# EAGLE design untitled (EAGLE 9.6.2)
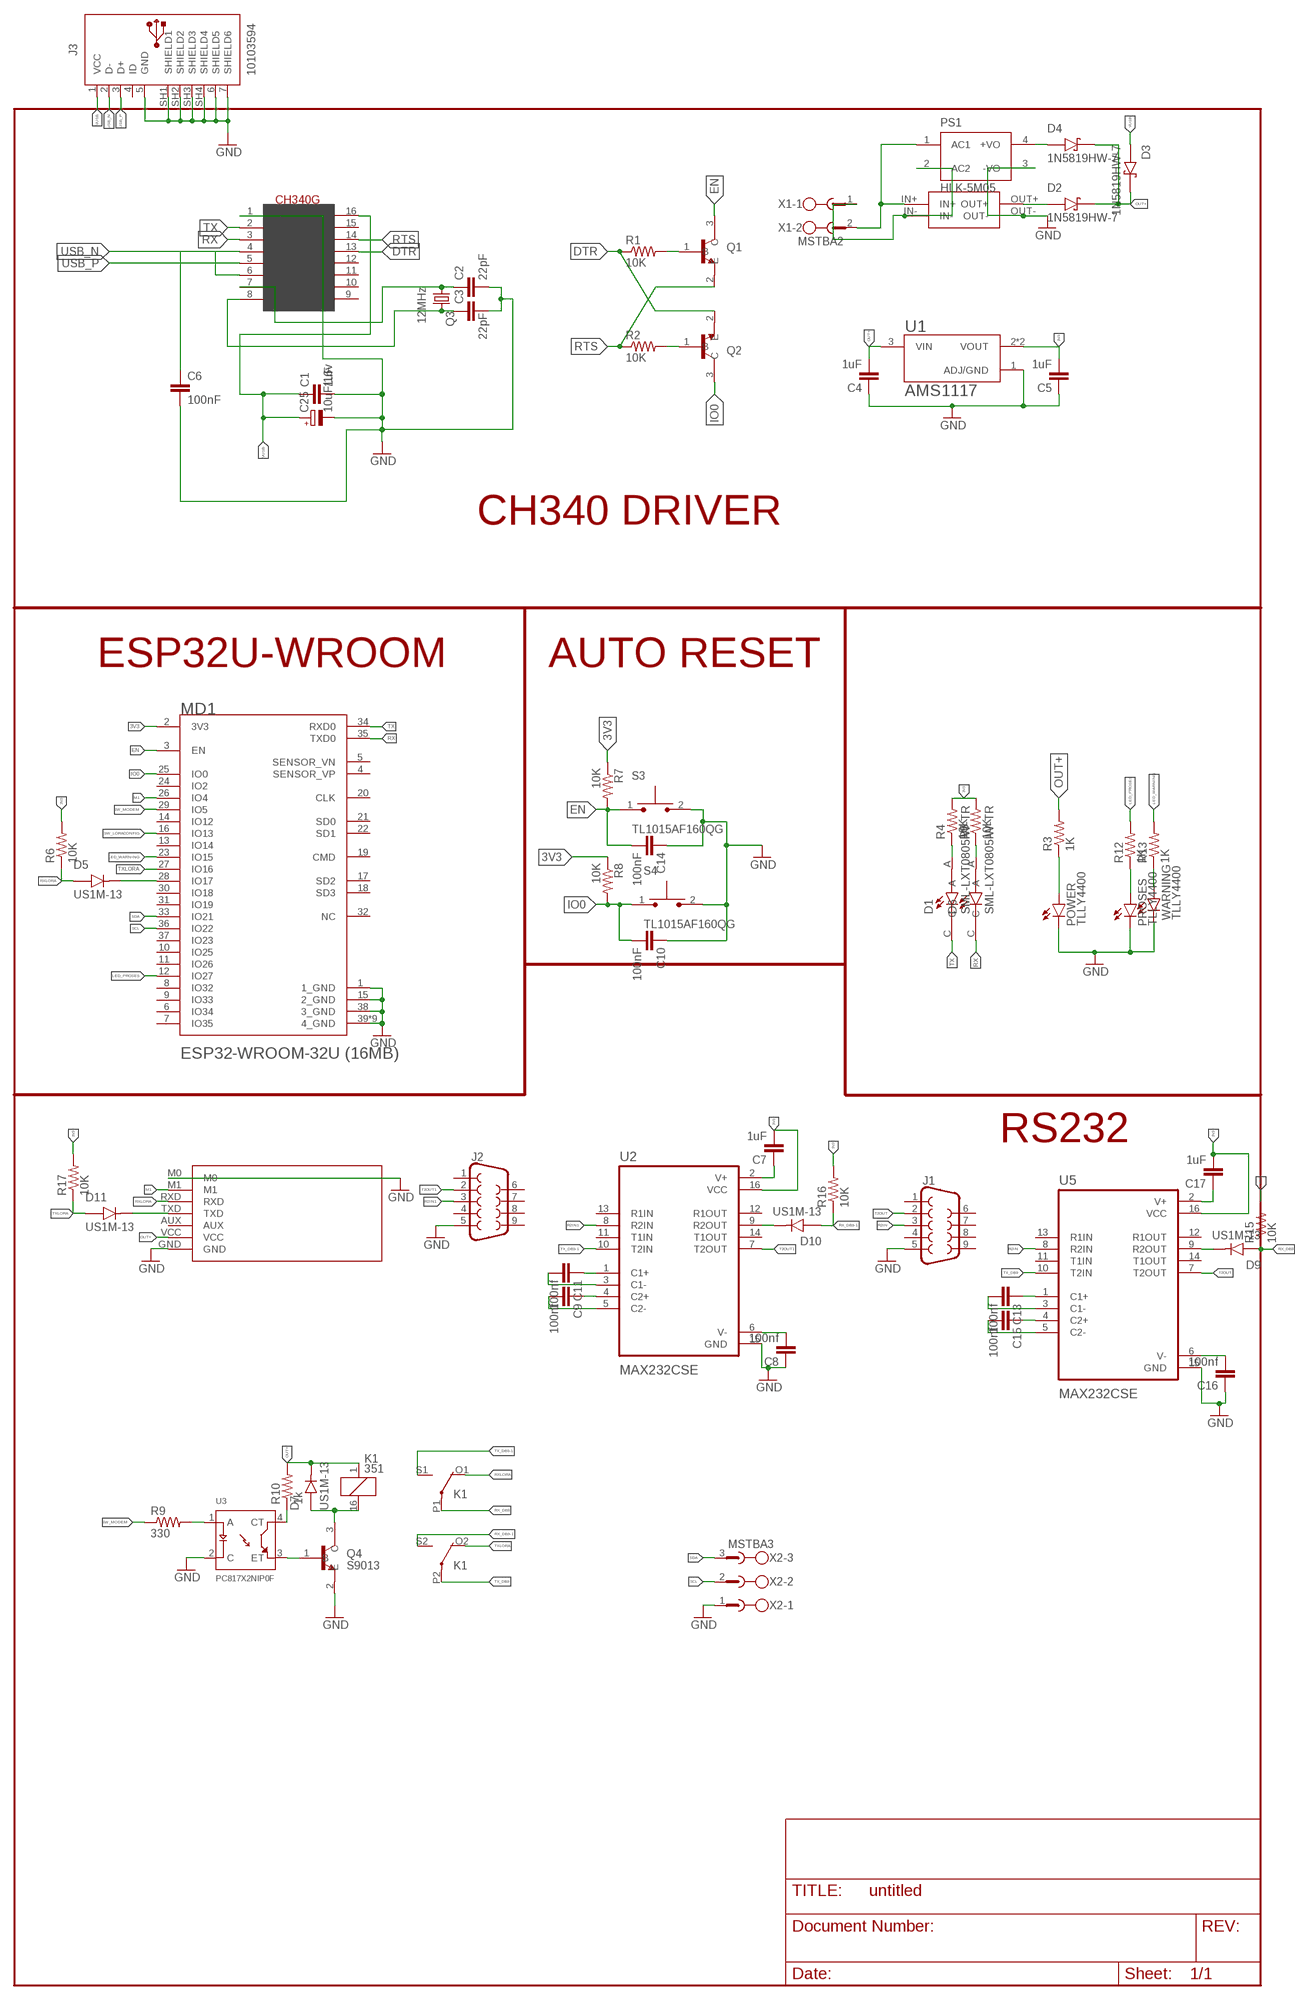
[diagram p0: schematic, sheet 1]

## Parts
C1  1uF  C-EUC0805K  [C0805K]
C2  22pF  C-EUC0805K  [C0805K]
C3  22pF  C-EUC0805K  [C0805K]
C4  1uF  C-EUC0805K  [C0805K]
C5  1uF  C-EUC0805K  [C0805K]
C6  100nF  C-EUC0805K  [C0805K]
C7  1uF  C-EUC0805  [C0805]
C8  100nf  C-EUC0805  [C0805]
C9  100nf  C-EUC0805  [C0805]
C10  100nF  C-EUC0805K  [C0805K]
C11  100nf  C-EUC0805  [C0805]
C13  100nf  C-EUC0805  [C0805]
C14  100nF  C-EUC0805K  [C0805K]
C15  100nf  C-EUC0805  [C0805]
C16  100nf  C-EUC0805  [C0805]
C17  1uF  C-EUC0805  [C0805]
C25  10uF/16v  CPOL-EU153CLV-0505  [153CLV-0505]
D1  SML-LXT0805IW-TR  [LEDC2012X120N]
D2  1N5819HW-7  [SOD3715X145N]
D3  1N5819HW-7  [SOD3715X145N]
D4  1N5819HW-7  [SOD3715X145N]
D5  US1M-13  [DIOM5226X240N]
D6  SML-LXT0805IW-TR  [LEDC2012X120N]
D7  US1M-13  [DIOM5226X240N]
D9  US1M-13  [DIOM5226X240N]
D10  US1M-13  [DIOM5226X240N]
D11  US1M-13  [DIOM5226X240N]
EBYTEE220-900T22D1  EBYTEE220-900T22D  [EBYTEE220-900T22D]
J1  DB9MALE  [DB9_MALE]
J2  DB9MALE  [DB9_MALE]
J3  10103594  [10103594]
K1  351  [351]
MD1  ESPRESSIF_SYSTEMS_ESP32-WROOM-32U_16MBESPRESSIF_SYSTEMS_ESP32-WROOM-32U_16MB_0_0  [ESPRESSIF_SYSTEMS_ESP32-WROOM-32U_16MB_0]
MINI1  MINI560  [MINI560]
POWER  TLLY4400  [LED3MM]
PROSES  TLLY4400  [LED3MM]
PS1  HLK-5M05  [CONV_HLK-5M05]
Q1  MMBT3904  [SOT95P240X120-3N]
Q2  MMBT3904  [SOT95P240X120-3N]
Q3  12MHz  CRYSTALSM49  [SM49]
Q4  S9013  [SOT95P240X120-3N]
R1  10K  R-US_M0805  [M0805]
R2  10K  R-US_M0805  [M0805]
R3  1K  R-US_M0805  [M0805]
R4  10K  R-US_M0805  [M0805]
R5  10K  R-US_M0805  [M0805]
R6  10K  R-US_M0805  [M0805]
R7  10K  R-US_M0805  [M0805]
R8  10K  R-US_M0805  [M0805]
R9  330  R-US_M0805  [M0805]
R10  1k  R-US_M0805  [M0805]
R12  1K  R-US_M0805  [M0805]
R13  1K  R-US_M0805  [M0805]
R15  10K  R-US_M0805  [M0805]
R16  10K  R-US_M0805  [M0805]
R17  10K  R-US_M0805  [M0805]
S3  TL1015AF160QG  [SW_TL1015AF160QG]
S4  TL1015AF160QG  [SW_TL1015AF160QG]
U1  AMS1117  [SOT229P700X180-4N]
U2  MAX232CSE  [SOIC127P600X175-16N]
U3  PC817X2NIP0F  [SOT254P975X400-4N]
U5  MAX232CSE  [SOIC127P600X175-16N]
U$2  CH340G  [SOIC16]
WARNING  TLLY4400  [LED3MM]
X1  MSTBA2  [MSTBA2]
X2  MSTBA3  [MSTBA3]

## Nets
3V3: C5.2 C7.2 C17.2 MD1.2(3V3) R4.2 R5.2 R6.2 R7.1 R8.1 R15.2 R16.2 R17.2 U1.2(VOUT) U1.4(VOUT) U2.16(VCC) U5.16(VCC)
DTR: Q2.2(E) R1.1 U$2.13(DTR)
EN: C14.2 MD1.3(EN) Q1.3(C) R7.2 S3.1
GND: C1.2 C2.2 C3.2 C4.1 C5.1 C6.2 C8.1 C10.1 C14.1 C16.1 C25.- EBYTEE220-900T22D1.GND EBYTEE220-900T22D1.M0 J1.5 J2.5 J3.5(GND) J3.6(SHIELD5) J3.7(SHIELD6) J3.SH1(SHIELD1) J3.SH2(SHIELD2) J3.SH3(SHIELD3) J3.SH4(SHIELD4) MD1.1(1_GND) MD1.15(2_GND) MD1.38(3_GND) MD1.39(4_GND) MD1.39-2(4_GND) MD1.39-3(4_GND) MD1.39-4(4_GND) MD1.39-5(4_GND) MD1.39-6(4_GND) MD1.39-7(4_GND) MD1.39-8(4_GND) MD1.39-9(4_GND) MINI1.OUT- POWER.K(C) PROSES.K(C) PS1.3(-VO) Q4.2(E) S3.2 S4.2 U1.1(ADJ/GND) U2.15(GND) U3.2(C) U5.15(GND) U$2.1(GND) WARNING.K(C) X2.1
IO0: C10.2 MD1.25(IO0) Q2.3(C) R8.2 S4.1
LED_PROSES: MD1.12(IO27) R12.2
LED_WARNING: MD1.23(IO15) R13.2
M1: EBYTEE220-900T22D1.M1 MD1.26(IO4)
N$1: C2.1 Q3.1 U$2.7(XI)
N$2: C3.1 Q3.2 U$2.8(XO)
N$3: POWER.A R3.1
N$4: Q1.1(B) R1.2
N$5: Q2.1(B) R2.2
N$6: MINI1.IN+ PS1.1(AC1) X1.2
N$7: C7.1 U2.2(V+)
N$8: D1.A R4.1
N$9: D6.A R5.1
N$10: C13.1 U5.1(C1+)
N$11: D2.A MINI1.OUT+
N$12: C6.1 U$2.4(V3)
N$13: D5.C(K) MD1.28(IO17)
N$14: C13.2 U5.3(C1-)
N$15: R9.2 U3.1(A)
N$16: R10.1 U3.4(CT)
N$17: C8.2 U2.6(V-)
N$18: Q4.1(B) U3.3(ET)
N$19: C15.1 U5.4(C2+)
N$20: C9.1 U2.4(C2+)
N$21: C9.2 U2.5(C2-)
N$22: C11.2 U2.3(C1-)
N$23: C11.1 U2.1(C1+)
N$24: C15.2 U5.5(C2-)
N$25: PROSES.A R12.1
N$26: C17.1 U5.2(V+)
N$27: C16.2 U5.6(V-)
N$28: R13.1 WARNING.A
N$29: D7.A K1.16 Q4.3(C)
N$34: MINI1.IN- PS1.2(AC2) X1.1
N$35: D4.A PS1.4(+VO)
N$38: D9.C(K) U5.9(R2OUT)
N$39: D10.C(K) U2.9(R2OUT)
N$40: D11.C(K) EBYTEE220-900T22D1.TXD
OUT+: C4.2 D2.C(K) D3.C(K) D4.C(K) D7.C(K) EBYTEE220-900T22D1.VCC K1.1 R3.2 R10.2 U1.3(VIN)
R2IN: J1.3 U5.8(R2IN)
R2IN1: J2.3 U2.8(R2IN)
RTS: Q1.2(E) R2.1 U$2.14(RTS)
RX: D6.C MD1.35(TXD0) U$2.3(RX)
RX_DB9: D9.A K1.P1(2:P) R15.1
RX_DB9-1: D10.A K1.S2(3:S) R16.1
RXLORA: D5.A EBYTEE220-900T22D1.RXD K1.O1(2:O) R6.1
SCL: MD1.36(IO22) X2.2
SDA: MD1.33(IO21) X2.3
SW_LORACONFIG: MD1.16(IO13)
SW_MODEM: MD1.29(IO5) R9.1
T2OUT: J1.2 U5.7(T2OUT)
T2OUT1: J2.2 U2.7(T2OUT)
TX: D1.C MD1.34(RXD0) U$2.2(TX)
TX_DB9: K1.P2(3:P) U5.10(T2IN)
TX_DB9-1: K1.S1(2:S) U2.10(T2IN)
TXLORA: D11.A K1.O2(3:O) MD1.27(IO16) R17.1
USB_N: J3.2(D-) U$2.6(D-)
USB_P: J3.3(D+) U$2.5(D+)
VUSB: C1.1 C25.+ D3.A J3.1(VCC) U$2.16(VCC)
Unconnected: EBYTEE220-900T22D1.AUX J1.1 J1.4 J1.6 J1.7 J1.8 J1.9 J2.1 J2.4 J2.6 J2.7 J2.8 J2.9 J3.4(ID) MD1.4(SENSOR_VP) MD1.5(SENSOR_VN) MD1.6(IO34) MD1.7(IO35) MD1.8(IO32) MD1.9(IO33) MD1.10(IO25) MD1.11(IO26) MD1.13(IO14) MD1.14(IO12) MD1.17(SD2) MD1.18(SD3) MD1.19(CMD) MD1.20(CLK) MD1.21(SD0) MD1.22(SD1) MD1.24(IO2) MD1.30(IO18) MD1.31(IO19) MD1.32(NC) MD1.37(IO23) U2.11(T1IN) U2.12(R1OUT) U2.13(R1IN) U2.14(T1OUT) U5.11(T1IN) U5.12(R1OUT) U5.13(R1IN) U5.14(T1OUT) U$2.9(CTS) U$2.10(DSR) U$2.11(RI) U$2.12(DCD) U$2.15(RS232)

## Notes on the sheet
- CH340 DRIVER
- ESP32U-WROOM | AUTO RESET
- RS232

## Library data of the parts
C1-C11 C13-C17 = rcl:C-EU: CAPACITOR, European symbol; SPICEPREFIX: C
C25 = rcl:CPOL-EU: POLARIZED CAPACITOR, European symbol; SPICEPREFIX: C
D1 D6 = SML-LXT0805IW-TR:SML-LXT0805IW-TR: LED; Luminous Intensity:11µcd; Viewing Angle:140°; Forward Current:30mA; Forward Voltage:2V; Color:Red; LED Color:Red; Leaded Process Compatible:Yes; Lens Color:White; Mounting Type:Surface Mount ;RoHS Compliant: Yes Check availability <https://pricing.snapeda.com/parts/SML-LXT0805IW-TR/Lumex%20Opto/Components/view-part?ref=eda>; AVAILABILITY: In Stock; DESCRIPTION: Red - LED Indication - Discrete 2V 0805 (2012 Metric); MF: Lumex Opto/Components; MP: SML-LXT0805IW-TR; PACKAGE: 0805 Lumex; PRICE: None; PURCHASE-URL: https://pricing.snapeda.com/search/part/SML-LXT0805IW-TR/?ref=eda
D2-D4 = 1N5819HW-7:1N5819HW-7: 1N5819HW Series 40 V 1 A Surface Mount Schottky Barrier Rectifier - SOD-123 Check availability <https://pricing.snapeda.com/parts/1N5819HW-7/Diodes%20Inc./view-part?ref=eda>; AVAILABILITY: In Stock; DESCRIPTION: Diode Schottky 40 V 1A Surface Mount SOD-123; MF: Diodes Inc.; MP: 1N5819HW-7; PACKAGE: SOD-123 Fairchild Semiconductor; PRICE: None; PURCHASE-URL: https://pricing.snapeda.com/search/part/1N5819HW-7/?ref=eda
D5 D7 D9-D11 = US1M-13:US1M-13: Diode, Fast Recovery, 1a, 1kv, Do-214ac-2, Full Reel Check availability <https://pricing.snapeda.com/parts/US1M-13/Diodes%20Incorporated/view-part?ref=eda>; AVAILABILITY: In Stock; DESCRIPTION: Diode Standard 1000 V 1A Surface Mount SMA; MF: Diodes Incorporated; MP: US1M-13; PACKAGE: DO-214AC-214 Diodes Incorporated; PRICE: None; PURCHASE-URL: https://pricing.snapeda.com/search/part/US1M-13/?ref=eda
EBYTEE220-900T22D1 = EByte E220-900T22D:EBYTEE220-900T22D
J1 J2 = SparkFun-Connectors:DB9: DB9 Connector Standard DB9 (D-Sub 9) serial connector. Can be used for CAN bus as well as RS485 and RS232. Footprint production proven. Here is the female version connector we sell at SparkFun: 9 Pin Female Serial Connector - PCB Mount <https://www.sparkfun.com/products/429> (PRT-00429) This connector has been used on the following SparkFun products: SparkFun RS232 Shifter - SMD <https://www.sparkfun.com/products/449> (PRT-00449) SparkFun RS232 Shifter SMD (No DB9) <https://www.sparkfun.com/products/8780> (PRT-08780); PROD_ID: CONN-09904
J3 = Connector_USB:10103594: USB(2.0) Micro-B, RCPT, 5POS, SMD-THT-R/A Datasheet <https://cdn.amphenol-icc.com/media/wysiwyg/files/documentation/datasheet/inputoutput/io_usb_micro.pdf> Drawing <https://cdn.amphenol-icc.com/media/wysiwyg/files/drawing/10103594.pdf>; CATEGORY: Connectors; CONTACTS: 5; CURRENT-RATING: 1.8A; DESCRIPTION: CONN RCPT USB2.0 MICRO B SMD R/A; GENDER: Receptacle; MANUFACTURER: Amphenol ICC (FCI); MOUNT_TYPE: R/A; MPN: 10103594-0001LF; OPERATING_TEMPERATURE: -30°C ~ 80°C; PART_STATUS: ACTIVE; ROHS_COMPLIANT: COMPLIANT; SUB_CATEGORY: USB; TYPE: USB-micro B; VOLTAGE-RATING: 100VAC
K1 = relay:351: RELAY 2 x switch, Omron; OC_FARNELL: unknown; OC_NEWARK: unknown
MD1 = Espressif Systems - ESP32-WROOM-32U (16MB):ESPRESSIF_SYSTEMS_ESP32-WROOM-32U_16MB: Bluetooth, WiFi 802.11b/g/n, Bluetooth v4.2 +EDR, Class 1, 2 and 3 Transceiver Module 2.4GHz ~ 2.5GHz Antenna Not Included, U.FL Surface Mount; AUTOMOTIVE: No; BANDWIDTH: 72MHz; CENTROID_NOT_SPECIFIED: No; DATASHEET: https://www.espressif.com/sites/default/files/documentation/esp32-wroom-32d_esp32-wroom-32u_datasheet_en.pdf; DATA_RATE: 150Mbits/s; DEVICE_CLASS_L1: Integrated Circuits (ICs); DEVICE_CLASS_L2: RF Semiconductors and Devices; DEVICE_CLASS_L3: Transceivers; DIGIKEY_DESCRIPTION: RX TXRX MODULE WIFI U.FL SMD; DIGIKEY_PART_NUMBER: 1904-1028-1-ND; FOOTPRINT_VARIANT_NAME_0: Recommended_Land_Pattern; HEIGHT: 3.35mm; INTERFACE: I2C,SPI,UART,Ethernet,I2S,Other; LEAD_FREE: Yes; MAX_FREQUENCY: 2484MHz; MAX_SUPPLY_VOLTAGE: 3.6V; MF: Espressif Systems; MFG_PACKAGE_IDENT: 0; MFG_PACKAGE_IDENT_DATE: 0; MFG_PACKAGE_IDENT_REV: 0; MIN_SUPPLY_VOLTAGE: 3V; MOUSER_PART_NUMBER: 356-ES32WROOM32U16MB; MPN: ESP32-WROOM-32U (16MB); NOMINAL_SUPPLY_CURRENT: 0.5A; NUMBER_OF_ADC_CHANNELS: 16; NUMBER_OF_GPIO: 26; PACKAGE: BT_MODULE; PREFIX: MD; ROHS: Yes; SENSITIVITY: -98dBm; TEMPERATURE_RANGE_HIGH: +85°C; TEMPERATURE_RANGE_LOW: -40°C; VERIFICATION_VERSION: 0.0.0.3
MINI1 = MINI560:MINI560
POWER PROSES WARNING = led:TLLY4400: Low Current (2mA) LED 3 mm Tinted Diffused Package color YELLOW Source: Data sheet <http://www.farnell.com/datasheets/391098.pdf>; MF: VISHAY SEMICONDUCTOR; OC_FARNELL: 1612439
PS1 = HLK-5M05:HLK-5M05: AC DC 220V to 5V 5W 5Watt Isolated Switching Step-Down Power Supply Module Converter Check availability <https://pricing.snapeda.com/parts/HLK-5M05/Hi-link/view-part?ref=eda>; AVAILABILITY: Not in stock; MF: Hi-link; MP: HLK-5M05; PACKAGE: Package; PRICE: None
Q1 Q2 = MMBT3904:MMBT3904: MMBT3904 Series 40 V CE Breakdown 0.2 A NPN General Purpose Amplifier - SOT-23 Check availability <https://pricing.snapeda.com/parts/MMBT3904/STMicroelectronics/view-part?ref=eda>; AVAILABILITY: Not in stock; DESCRIPTION: SMD Transistor MMBT3904 SOT-23 SMD DIOTEC; MF: STMicroelectronics; MP: MMBT3904; PACKAGE: SOT-23 ON; PRICE: None
Q3 = adafruit:CRYSTAL: CRYSTAL; OC_FARNELL: unknown; OC_NEWARK: unknown
Q4 = S9013:S9013: SMD Transistors NPN 25V-500mA Check availability <https://pricing.snapeda.com/parts/S9013/JCET/view-part?ref=eda>; AVAILABILITY: In Stock; DESCRIPTION: Bipolar (BJT) Transistor NPN 20V 500mA 625mW Through Hole TO-92-3; MF: JCET; MP: S9013; PACKAGE: SOT-23-3 JCET; PRICE: None; PURCHASE-URL: https://pricing.snapeda.com/search/part/S9013/?ref=eda
R1-R10 R12 R13 R15-R17 = adafruit:R-US_: RESISTOR, American symbol
S3 S4 = TL1015AF160QG:TL1015AF160QG: Tactile Switch SPST-NO Top Actuated Surface Mount Check availability <https://pricing.snapeda.com/parts/TL1015AF160QG/E-Switch/view-part?ref=eda>; AVAILABILITY: In Stock; DESCRIPTION: Tactile Switch SPST-NO Top Actuated Surface Mount; MF: E-Switch; MP: TL1015AF160QG; PACKAGE: None; PRICE: None; PURCHASE-URL: https://pricing.snapeda.com/search/part/TL1015AF160QG/?ref=eda
U1 = AMS1117:AMS1117: Sot223/Pkg 1-Amp 5-Volt Low Drop Out Voltage Regulatator Check availability <https://pricing.snapeda.com/parts/AMS1117/Advanced%20Monolithic%20Systems/view-part?ref=eda>; AVAILABILITY: Not in stock; DESCRIPTION: 1A LOW DROPOUT VOLTAGE REGULATOR SOT-223; MF: Advanced Monolithic Systems; MP: AMS1117; PACKAGE: SOT-223 Seeed Technology; PRICE: None
U2 U5 = MAX232CSE:MAX232CSE: Check availability <https://pricing.snapeda.com/parts/MAX232CSE/Maxim%20Integrated/view-part?ref=eda>; AVAILABILITY: In Stock; DESCRIPTION: 2/2 Transceiver Full RS232 16-SOIC; MF: Maxim Integrated; MP: MAX232CSE; PACKAGE: SOIC-16 Maxim Integrated; PRICE: None; PURCHASE-URL: https://pricing.snapeda.com/search/part/MAX232CSE/?ref=eda
U3 = PC817X2NIP0F:PC817X2NIP0F: PC817 Series 1 Channel 80 V 5000 Vrms General Purpose Photocoupler - DIP-4 Check availability <https://pricing.snapeda.com/parts/PC817X2NIP0F/Sharp%20Microelectronics/view-part?ref=eda>; AVAILABILITY: Not in stock; DESCRIPTION: Optoisolator Transistor Output 5000Vrms 1 Channel 4-SMD; MF: Sharp Microelectronics; MP: PC817X2NIP0F; PACKAGE: SMD-4 Sharp Microelectronics; PRICE: None
U$2 = usb-serial:CH340G
X1 = con-phoenix-508:MSTBA2: PHOENIX; MF: FARNELL; MPN: 1757242; OC_FARNELL: 3705171; OC_NEWARK: 71C4161
X2 = con-phoenix-508:MSTBA3: PHOENIX; MF: FARNELL; MPN: 1757255; OC_FARNELL: 3705183; OC_NEWARK: 71C4162

## Net classes
0 default: width 0.2 mm, clearance 0.15 mm

## Board
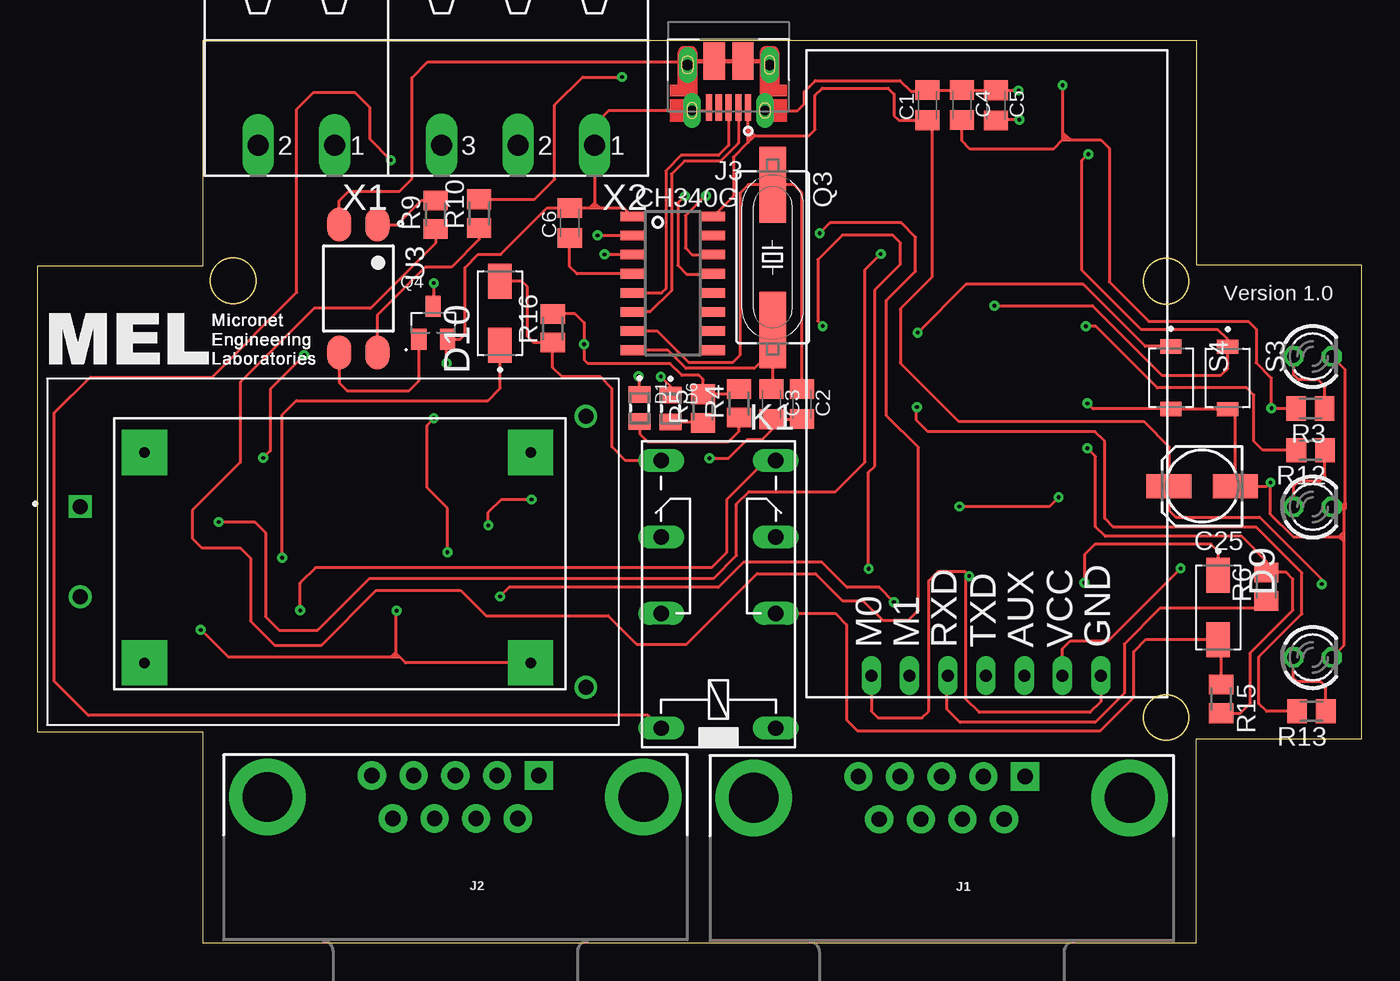
[diagram p1: board, top side]
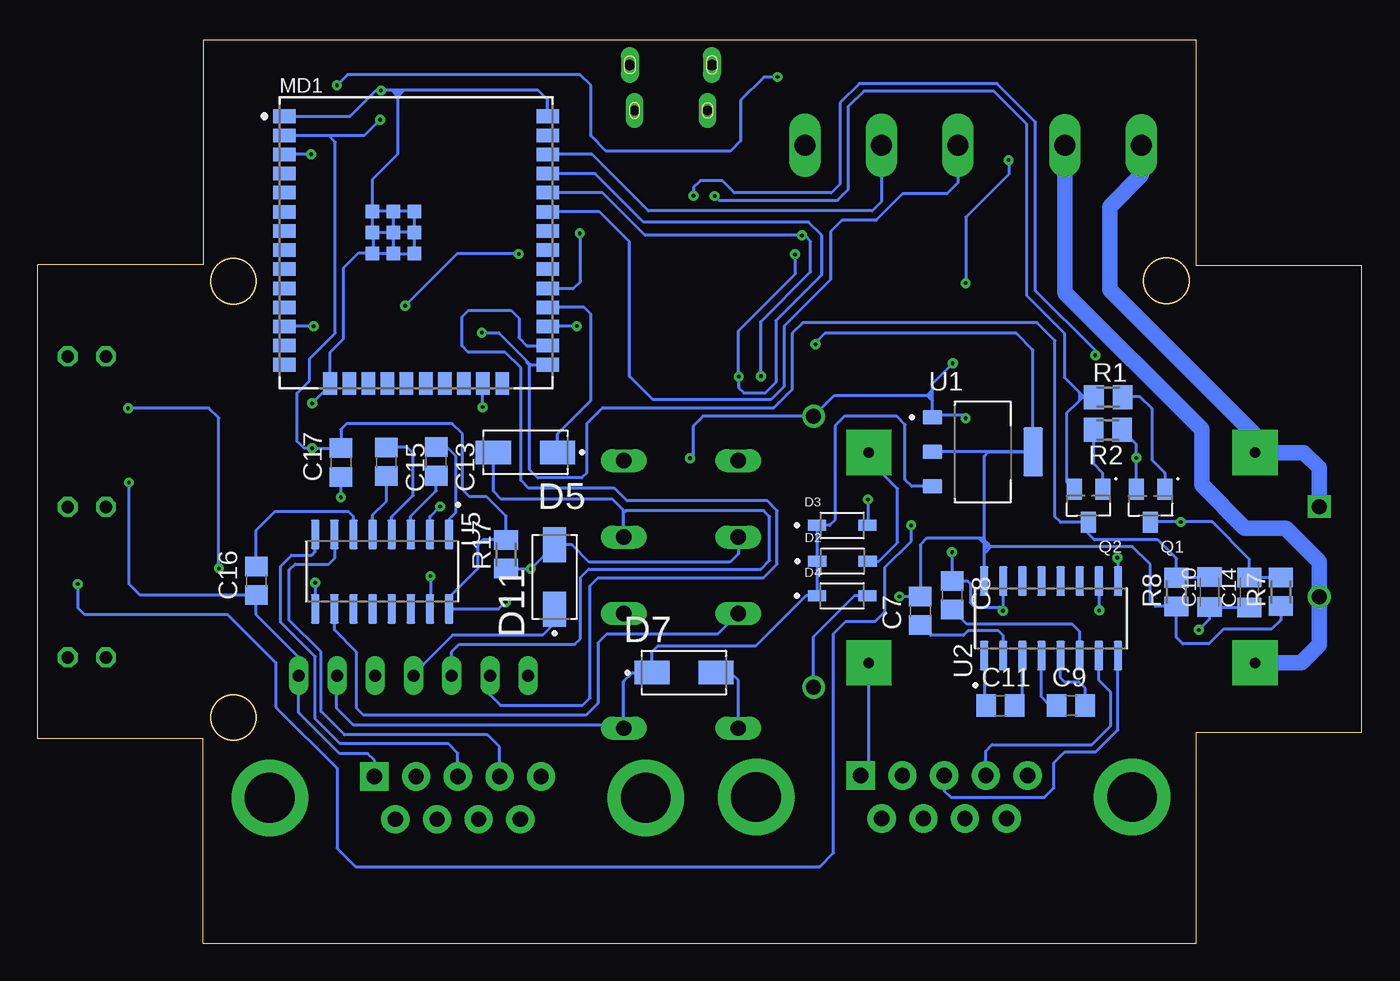
[diagram p2: board, bottom side, seen from below]

Size 88.01 x 60 mm. Coordinates in mm from the lower left corner, seen from the top.
Outline: 11,60 77,60 77,45.07 88.01,45.07 88.01,13.57 77,13.57 77,0 11,0 11,14 0,14 0,45 11,45 11,60
Outline: circle at 75,15 radius 1.5
Outline: circle at 75,43.98 radius 1.5
Outline: circle at 12.99,44 radius 1.5
Copper layers (1*16): Top 0.035mm / dielectric 1.5mm / Bottom 0.035mm
Design rules "default *": minimum track width 6mil, minimum drill 0.25mm, track to track 6mil, track to pad 6mil, pad to pad 6mil, via to via 6mil, smd to smd 6mil, copper to edge 40mil, drill to drill 6mil, minimum pad ring 10mil, minimum via ring 8mil, stop-mask expansion 4mil, vias tented up to drill 0mil, thermal gap 10mil

### Footprints (pad centres in the part's own frame; a part is rotated, then mirrored left to right if it is on the bottom)
C0805K = smd 1.3 x 1.6: 1 -1,0; 2 1,0
C0805 = smd 1.3 x 1.5: 1 -0.95,0; 2 0.95,0
153CLV-0505 = smd 3 x 1.6: + 2.2,0; - -2.2,0
LEDC2012X120N = smd 1.1 x 1.45: A 0.9,0; C -0.9,0
SOD3715X145N = smd 1.21 x 0.73: A 1.68,0; C -1.68,0
DIOM5226X240N = smd 2.33 x 1.55: A 2.135,0; C -2.135,0
EBYTEE220-900T22D = drill 0.8 pad 1.27 long: AUX -4.56,-10.98; GND -4.56,-16.06; M0 -4.56,-0.82; M1 -4.56,-3.36; RXD -4.56,-5.9; TXD -4.56,-8.44; VCC -4.56,-13.52
DB9_MALE = drill 1.016 pad 1.88: 1 5.54,-1.42; 2 2.77,-1.42; 3 0,-1.42; 4 -2.77,-1.42; 6 4.15,1.42; 7 1.38,1.42; 8 -1.38,1.42; 9 -4.15,1.42 | drill 1.016 pad 1.88 square: 5 -5.54,-1.42 | drill 3.302 pad 5.08: G1 -12.5,0; G2 12.5,0
10103594 = smd 0.4 x 1.75: 1 -1.3,2.825; 2 -0.65,2.825; 3 0,2.825; 4 0.65,2.825; 5 1.3,2.825 | smd 1.425 x 2.5: 6 -0.963,-0.25; 7 0.963,-0.25 | drill 0.65 pad 0.73 long: SH1 -2.425,3.03; SH2 2.425,3.03 | drill 0.7 long: SH3 -2.725,0; SH4 2.725,0
351 = drill 1.016 long: 1 -3.81,-3.81; 16 -3.81,3.81; O1 8.89,-3.81; O2 8.89,3.81; P1 3.81,-3.81; P2 3.81,3.81; S1 13.97,-3.81; S2 13.97,3.81
ESPRESSIF_SYSTEMS_ESP32-WROOM-32U_16MB_0 = smd 1.5 x 0.9: 1 -8.75,8.41; 2 -8.75,7.14; 3 -8.75,5.87; 4 -8.75,4.6; 5 -8.75,3.33; 6 -8.75,2.06; 7 -8.75,0.79; 8 -8.75,-0.48; 9 -8.75,-1.75; 10 -8.75,-3.02; 11 -8.75,-4.29; 12 -8.75,-5.56; 13 -8.75,-6.83; 14 -8.75,-8.1; 25 8.75,-8.1; 26 8.75,-6.83; 27 8.75,-5.56; 28 8.75,-4.29; 29 8.75,-3.02; 30 8.75,-1.75; 31 8.75,-0.48; 32 8.75,0.79; 33 8.75,2.06; 34 8.75,3.33; 35 8.75,4.6; 36 8.75,5.87; 37 8.75,7.14; 38 8.75,8.41 | smd 0.9 x 1.5: 15 -5.71,-9.35; 16 -4.44,-9.35; 17 -3.17,-9.35; 18 -1.9,-9.35; 19 -0.63,-9.35; 20 0.64,-9.35; 21 1.91,-9.35; 22 3.18,-9.35; 23 4.45,-9.35; 24 5.72,-9.35 | smd 0.9 x 0.9: 39 -2.9,2.09; 39-2 -1.5,0.69; 39-3 -1.5,2.09; 39-4 -0.1,2.09; 39-5 -0.1,-0.71; 39-6 -1.5,-0.71; 39-7 -2.9,-0.71; 39-8 -0.1,0.69; 39-9 -2.9,0.69
MINI560 = drill 0.7 pad 3 square: IN+ 0,-1.27; IN- 0,-15.24; OUT+ 25.67,-1.27; OUT- 25.67,-15.24
LED3MM = drill 0.813 octagon: A -1.27,0; K 1.27,0
CONV_HLK-5M05 = drill 1 pad 1.5 square: 1 -16.8,3 | drill 1 pad 1.5: 2 -16.8,-3; 3 16.8,9; 4 16.8,-9
SOT95P240X120-3N = smd 1 x 1.4: 1 -0.95,-1.1; 2 0.95,-1.1; 3 0,1.1
SM49 = smd 5.08 x 1.778: 1 -4.826,0; 2 4.826,0
M0805 = smd 1.3 x 1.6: 1 -0.95,0; 2 0.95,0
SW_TL1015AF160QG = smd 0.95 x 1.4: 1 -2.075,0; 2 2.075,0
SOT229P700X180-4N = smd 1.31 x 0.93: 1 -3.345,2.29; 2 -3.345,0; 3 -3.345,-2.29 | smd 1.31 x 3.24: 4 3.345,0
SOIC127P600X175-16N = smd 1.97 x 0.59: 1 -2.475,4.445; 2 -2.475,3.175; 3 -2.475,1.905; 4 -2.475,0.635; 5 -2.475,-0.635; 6 -2.475,-1.905; 7 -2.475,-3.175; 8 -2.475,-4.445; 9 2.475,-4.445; 10 2.475,-3.175; 11 2.475,-1.905; 12 2.475,-0.635; 13 2.475,0.635; 14 2.475,1.905; 15 2.475,3.175; 16 2.475,4.445
SOT254P975X400-4N = smd 2.25 x 1.6: 1 -4.25,1.27; 2 -4.25,-1.27; 3 4.25,-1.27; 4 4.25,1.27
SOIC16 = smd 0.635 x 1.524: 1 -4.445,-2.695; 2 -3.175,-2.695; 3 -1.905,-2.695; 4 -0.635,-2.695; 5 0.635,-2.695; 6 1.905,-2.695; 7 3.175,-2.695; 8 4.445,-2.695; 9 4.445,2.695; 10 3.175,2.695; 11 1.905,2.695; 12 0.635,2.695; 13 -0.635,2.695; 14 -1.905,2.695; 15 -3.175,2.695; 16 -4.445,2.695
MSTBA2 = drill 1.397 long: 1 -2.54,5.08; 2 2.54,5.08
MSTBA3 = drill 1.397 long: 1 -5.08,5.08; 2 0,5.08; 3 5.08,5.08

### Placement (x,y rotation side)
C1  59.13,55.67 90 top
C2  50.79,35.81 270 top
C3  48.76,35.8 270 top
C4  61.43,55.68 270 top
C5  63.69,55.67 270 top
C6  35.37,47.84 90 top
C7  29.35,22.08 90 bottom
C8  27.23,23.12 270 bottom
C9  19.34,15.78 0 bottom
C10  10.12,23.32 90 bottom
C11  24.02,15.78 0 bottom
C13  61.52,32 270 bottom
C14  7.47,23.3 90 bottom
C15  64.84,31.97 270 bottom
C16  73.47,24.07 90 bottom
C17  67.85,31.93 90 bottom
C25  77.39,30.36 180 top
D1  40,35.55 270 top
D2  34.52,25.38 0 bottom
D3  34.54,27.75 0 bottom
D4  34.54,23.07 0 bottom
D5  55.59,32.61 180 bottom
D6  42.05,35.51 270 top
D7  45.06,17.98 0 bottom
D9  78.46,22.3 270 top
D10  30.72,41.85 90 top
D11  53.65,24.33 90 bottom
EBYTEE220-900T22D1  54.59,22.34 90 top
J1  60.09,9.66 180 top
J2  27.76,9.71 180 top
J3  45.92,58.35 180 top
K1  45.25,18.09 90 top
MD1  62.86,46.53 0 bottom
MINI1  7.1,33.87 0 top
POWER  84.74,38.98 0 top
PROSES  84.74,28.98 0 top
PS1  19.64,26.01 0 top
Q1  14.05,29.05 180 bottom
Q2  18.17,29.06 180 bottom
Q3  48.85,45.56 270 top
Q4  26.29,41.22 0 top
R1  16.86,36.27 0 bottom
R2  16.88,34.1 180 bottom
R3  84.59,35.52 180 top
R4  46.62,35.86 90 top
R5  44.23,35.52 90 top
R6  81.67,23.69 90 top
R7  5.4,23.34 90 bottom
R8  12.33,23.32 90 bottom
R9  26.45,48.4 90 top
R10  29.35,48.47 90 top
R12  84.6,32.75 180 top
R13  84.66,15.4 180 top
R15  78.66,16.22 270 top
R16  34.24,40.84 90 top
R17  56.88,25.83 90 bottom
S3  79.09,37.55 270 top
S4  75.33,37.57 270 top
U1  25.2,32.64 0 bottom
U2  20.66,21.58 90 bottom
U3  21.32,43.49 270 top
U5  65.11,24.69 270 bottom
U$2  42.21,43.84 270 top
WARNING  84.74,18.98 0 top
X1  17.19,58.09 180 top
X2  31.93,58.09 180 top

### Tracks (layer width: path | path; a pad name or v marks a point on that pad's centre or on a via)
3V3  (via drill 0.25)
  Top 0.2: v65.26,54.7 63.72,54.7 C5.2 | R15.2 79.92,15.27 80.6,15.95 80.6,19.29 83.44,22.13 83.44,24.18 82.98,24.64 R6.2 81.67,25.37 80.02,27.02 70.96,27.02 70.31,27.66 70.31,32.33 v69.76,32.88 | R4.2 46.27,36.47 R5.2 44.23,37.45 43.96,37.72 42.82,37.72 42.03,38.51 36.57,38.51 36.32,38.76 36.32,39.77 v36.31,39.78 v36.31,39.79 v36.32,39.79 36.32,41.22 35.71,41.83 34.27,41.83 R16.2 | v56.91,22.66 55.94,23.63 53.8,23.63 52.13,25.3 46.91,25.3 45.24,23.63 31.34,23.63 v30.74,23.03
  Bottom 0.2: U2.16 25.1,25.87 | 25.1,26.54 25.45,26.88 | 25.45,26.88 28.93,26.88 29.35,26.47 C7.2 | C7.2 | 25.1,25.87 25.1,26.13 | 25.1,26.13 25.1,26.38 | 25.1,26.38 25.1,26.54 | 25.1,26.54 25.1,32.35 24.81,32.64 U1.4 | R7.1 5.4,21.46 6,20.86 9.2,20.86 10.19,19.87 11.9,19.87 12.34,20.32 12.34,22.36 R8.1 13.7,22.37 14.07,22.74 14.07,25.16 15.24,26.33 24.64,26.33 | MD1.2 68.68,53.67 | 68.68,53.67 66.29,53.67 v65.26,54.7 | 24.64,26.33 25.1,25.87 | R17.2 56.88,26.82 | 56.88,26.82 56.88,28.36 58.17,29.66 59.31,29.66 59.77,30.13 59.77,33.83 60.47,34.52 67.46,34.52 67.85,34.13 C17.2 v69.76,32.88 70.31,32.88 70.77,33.34 70.77,36.54 69.94,37.37 69.94,38.82 68.23,40.53 68.23,53.22 68.68,53.67 | 56.88,26.82 58.4,26.82 58.75,26.47 58.75,24.91 60.67,22.98 U5.16 57.36,22.21 v56.91,22.66 | U1.4 U1.2 | U1.4 21.85,39.4 22.96,40.51 35.68,40.51 36.31,39.89 v36.31,39.79 | v30.74,23.03 30.73,23.04 C7.2 | 24.64,26.33 24.81,26.51 | 24.81,26.51 24.92,26.61 | 24.92,26.61 25.19,26.88 25.45,26.88 | 24.81,26.51 24.81,26.42 25.1,26.13 | 24.92,26.61 24.92,26.57 25.1,26.38
DTR  (via drill 0.25)
  Top 0.2: v43.02,49.64 42.56,49.18 42.56,45.02 43.13,44.45 44.89,44.45 U$2.13
  Bottom 0.2: Q2.2 19.63,30.66 19.63,35.2 18.78,36.05 | 18.78,36.05 18.66,36.17 | 18.66,36.17 18.56,36.27 R1.1 18.46,36.27 18.62,36.43 | 18.78,36.6 19.78,37.59 19.78,40.52 22.28,43.02 22.28,54.42 24.47,56.61 33.1,56.61 34.16,55.55 34.16,50.04 34.85,49.34 42.73,49.34 v43.02,49.64 | 18.78,36.6 18.62,36.43 | 18.78,36.6 18.78,36.05 | 18.62,36.43 18.66,36.4 18.66,36.17
EN  (via drill 0.25)
  Top 0.2: v69.83,52.42 69.41,52 69.41,44.7 73.34,40.77 78.43,40.77 79.09,40.11 S3.1 79.09,38.17 78.61,37.7 74.75,37.7 70.1,42.35 v63.58,42.35 | v12.03,27.98 14.43,27.98 15.15,27.26 15.15,21.69 16.05,20.79 18.6,20.79 22.05,24.24 44.94,24.24 46.46,25.76 46.46,29.18 47.26,29.99 53.03,29.99 55,31.96 55,44.75 v56.04,45.79
  Bottom 0.2: R7.2 5.41,24.3 C14.2 7.47,25.5 9.95,27.98 v12.03,27.98 14.02,27.98 Q1.3 | v69.83,52.42 71.59,52.42 MD1.3 | v56.04,45.79 60.14,45.79 v63.58,42.35
GND  (via drill 0.25)
  Top 0.2: J3.5 44.41,55.32 J3.SH2 37.95,55.32 37.01,54.38 X2.1 37.01,49.17 | 36.68,48.84 C6.2 33.86,48.84 30.77,45.76 29.28,45.76 28.4,44.87 28.4,40.45 28.07,40.12 27.39,40.12 | 36.68,48.84 37.34,48.84 | 37.34,48.84 38.95,48.84 U$2.1 | 86.8,28.76 86.8,27.32 | 86.8,27.32 86.8,26.91 | 86.8,26.91 86.8,26.7 | 86.8,26.7 86.8,19.77 WARNING.K | 86.8,28.76 86.59,28.98 PROSES.K 86.61,28.98 86.66,29.03 | 86.66,29.03 86.9,29.27 | POWER.K 86.9,38.1 86.9,29.27 | 37.01,49.17 37.15,49.03 | 37.15,49.03 37.34,48.84 | v65.19,56.64 63.71,56.64 C5.1 63.67,56.68 C4.1 C1.2 59.04,56.58 58.04,56.58 57.32,57.31 51.69,57.31 50.96,56.57 50.96,55.77 50.51,55.32 J3.SH1 | 86.49,27 83.44,27 81.94,28.51 v81.94,30.6 81.7,30.36 C25.- 79.59,34.97 S3.2 75.35,35.47 S4.2 70.14,35.49 v69.78,35.86 v69.77,35.86 | 86.8,27.32 86.59,27.11 | 86.59,27.11 86.49,27 | C2.2 C3.2 48.77,34.08 48.16,33.47 47.17,33.47 45.93,32.22 v44.65,32.22 | Q4.2 27.39,40.12 | v27.19,38.52 27.19,39.92 27.39,40.12 | v10.83,20.81 10.88,20.81 12.67,19.02 23.5,19.02 | 23.5,19.02 23.67,19.2 | 23.67,19.2 23.82,19.34 | v23.86,22.07 23.82,22.04 23.82,19.34 | MINI1.OUT- 24.44,18.63 24.04,19.02 | 23.82,19.34 23.82,19.24 23.87,19.2 | 24.04,19.02 23.87,19.2 | EBYTEE220-900T22D1.M0 55.41,15.41 55.85,14.97 58.78,14.97 59.23,15.41 59.23,24.07 59.84,24.68 61.64,24.68 61.92,24.4 v61.91,24.38 61.69,24.17 61.69,16.21 62.58,15.33 69.94,15.33 70.65,16.04 EBYTEE220-900T22D1.GND | v27.24,25.96 27.24,28.89 25.89,30.24 25.89,34.42 v26.33,34.87 | 37.01,49.17 36.86,49.03 | 36.86,49.03 36.68,48.84 | 36.86,49.03 37.15,49.03 | 23.5,19.02 24.04,19.02 | 23.67,19.2 23.87,19.2 | 86.49,27 86.79,26.7 86.8,26.7
  Top 0.2: 86.59,27.11 86.78,26.91 86.8,26.91 | 86.9,29.27 86.9,28.95 | 86.9,28.95 86.9,28.86 86.8,28.76 | 86.66,29.03 86.74,28.95 86.9,28.95 | U3.2 20.05,49.32 20.68,49.95 24.06,49.95 24.88,50.77 24.88,57.51 25.92,58.55 42.99,58.55 J3.SH4
  Top 0.305: J3.SH2 43.19,55.62 J3.SH4 43.44,58.6 J3.7 J3.6 48.39,58.6 J3.SH3 48.64,55.62 J3.SH1
  Bottom 0.2: 64.38,48.62 MD1.39-3 MD1.39-4 MD1.39-8 | 64.38,48.62 65.75,48.62 | 65.75,48.62 MD1.39 65.76,50.74 64.07,52.43 64.07,56.25 | 65.75,48.62 65.76,48.6 MD1.39-9 65.68,47.22 | 65.68,47.22 64.38,47.22 | 64.38,47.22 MD1.39-2 | MD1.39-2 64.36,48.6 64.38,48.62 | MD1.39-8 MD1.39-2 | MD1.39-8 MD1.39-5 MD1.39-6 | MD1.39-6 64.36,47.2 64.38,47.22 | MD1.39-6 MD1.39-7 | MD1.39-7 65.68,45.9 65.68,47.22 | J1.5 65.63,12.14 66.08,12.59 67.93,12.59 70.65,15.31 EBYTEE220-900T22D1.GND 70.65,18.98 73.47,21.81 C16.1 81.2,23.12 81.94,23.86 v81.94,30.6 | J2.5 32.77,11.67 MINI1.OUT- | 27.18,24.12 C8.1 | C8.1 26.23,24.07 26.02,23.86 26.02,22.62 25.72,22.32 24.1,22.32 v23.86,22.07 23.86,24.03 U2.15 | C14.1 10.1,22.3 C10.1 10.12,21.52 v10.83,20.81 | MD1.1 67.25,54.94 65.53,56.66 65.21,56.66 v65.19,56.64 v65.19,56.65 64.46,56.65 | MD1.39-7 65.81,45.86 66.67,45.86 67.68,44.85 67.68,40.15 68.57,39.25 MD1.15 68.57,37.05 v69.77,35.86 | 64.07,56.25 64.25,56.44 | 64.25,56.44 64.46,56.65 | U1.1 28.54,35 | 28.54,35 28.54,36.05 | 28.54,36.05 28.54,36.76 | 28.54,36.76 28.54,37.17 v27.19,38.52 | 28.54,35 28.63,35.08 26.55,35.08 v26.33,34.87 | MD1.38 54.11,56.02 54.74,56.65 63.68,56.65 | 63.68,56.65 64.46,56.65 | v61.91,24.38 61.91,22.24 U5.15 | C8.1 27.23,25.96 v27.24,25.96 | v44.65,32.22 44.45,32.42 44.45,34.35 43.79,35.01 PS1.3 35.05,36.39 28.88,36.39 | 64.07,56.25 63.84,56.48 | 63.84,56.48 63.68,56.65 | 63.84,56.48 64.21,56.48 64.25,56.44 | 28.54,36.05 28.73,36.24 | 28.73,36.24 28.88,36.39 | 28.88,36.39 28.88,36.41 28.68,36.62 | 28.68,36.62 28.54,36.76 | 28.68,36.62 28.68,36.29 28.73,36.24
IO0  (via drill 0.25)
  Top 0.2: v58.49,40.56 61.7,43.77 69.5,43.77 73.61,39.66 73.6,39.64 S4.1
  Bottom 0.2: C10.2 12.28,24.32 R8.2 12.33,25.55 13.57,26.8 17.77,26.8 18.17,27.2 Q2.3 20.01,27.96 20.4,28.34 20.4,40.03 21.6,41.23 37.16,41.23 37.87,40.51 37.87,36.78 39.08,35.57 50.46,35.57 51.5,34.53 51.5,31.25 51.85,30.9 54.78,30.9 55.33,31.46 55.33,38.38 | v58.49,40.56 57.37,40.56 55.5,38.69 | 55.5,38.69 55.24,38.43 | 55.24,38.43 55.28,38.43 55.33,38.38 | 55.24,38.43 MD1.25 | 55.5,38.69 55.5,38.55 55.33,38.38
LED_PROSES  (via drill 0.25)
  Top 0.2: R12.2 81.43,32.75 80.84,33.34 80.84,36.4 80.35,36.9 74.41,36.9 70.32,40.98 v69.67,40.98
  Bottom 0.2: v69.67,40.98 71.6,40.98 MD1.12
LED_WARNING  (via drill 0.25)
  Top 0.2: R13.2 81.68,15.4 81.17,15.91 81.17,19.02 84.02,21.88 84.02,24.6 80.98,27.64 71.49,27.64 70.92,28.21 70.92,33.34 70.27,33.99 59.16,33.99 58.42,34.73 58.42,35.59 v58.43,35.61
  Bottom 0.2: v58.43,35.61 58.43,37.16 MD1.23
M1
  Bottom 0.2: EBYTEE220-900T22D1.M1 57.95,16.49 57.25,15.79 51.8,15.79 51.28,16.3 51.28,23.75 50.77,24.27 39.77,24.27 38.86,25.18 38.86,28.74 39.5,29.38 48.83,29.38 49.68,30.23 55.38,30.23 55.9,30.75 55.9,38.21 56.93,39.25 59.39,39.25 59.82,39.67 59.82,41.6 59.38,42.04 56.56,42.04 56.03,41.52 56.03,40.23 55.5,39.7 MD1.26
N$1
  Top 0.2: C2.1 50.79,49.85 50.26,50.39 Q3.1 47.23,50.39 46.68,49.83 46.68,39.05 46.19,38.56 43.29,38.56 41.19,40.67 U$2.7
N$2
  Top 0.2: C3.1 48.85,36.89 Q3.2 48.85,39.4 47.63,38.19 43.09,38.19 41.88,39.39 U$2.8 | U$2.8
N$3
  Top 0.2: R3.1 85.54,37 85.12,37.42 83.8,37.42 83.47,37.75 POWER.A
N$4
  Bottom 0.2: Q1.1 13.1,31.25 13.98,32.13 13.98,35.53 14.78,36.33 15.86,36.33 R1.2
N$5
  Bottom 0.2: R2.2 17.86,34.07 17.86,31.87 17.22,31.23 Q2.1
N$6
  Bottom 1.016: PS1.1 2.84,31.58 3.85,32.6 MINI1.IN+ 7.1,33.76 16.76,43.43 16.76,48.93 14.65,51.05 X1.2
N$7
  Bottom 0.2: U2.2 23.83,20.44 24.15,20.75 26.17,20.75 26.48,20.44 28.66,20.44 C7.1
N$8
  Top 0.2: D1.A 40,33.84 40.54,33.31 45.91,33.31 46.62,34.01 R4.1
N$9
  Top 0.2: R5.1 44.18,34.61 D6.A
N$10
  Bottom 0.2: U5.1 60.67,28.16 60.21,28.62 60.21,32.34 60.81,32.95 C13.1
N$11
  Bottom 0.2: D2.A 32.09,25.38 30.86,26.6 30.86,30.2 32.77,32.11 MINI1.OUT+
N$12
  Top 0.2: U$2.4 35.84,44.47 35.35,44.95 35.35,46.83 C6.1
N$13
  Bottom 0.2: D5.C 53.45,33.84 51.24,36.05 51.24,41.79 51.68,42.24 MD1.28
N$14
  Bottom 0.2: U5.3 63.21,28.35 61.52,30.04 C13.2
N$15
  Top 0.2: 26.44,49.4 R9.2 25.51,49.35 23.91,47.74 U3.1
N$16
  Top 0.2: U3.4 22.59,41.74 25.76,44.91 27.51,44.91 29.35,46.75 R10.1
N$17
  Bottom 0.2: U2.6 18.75,20.7 19.25,21.2 26.26,21.2 C8.2
N$18
  Top 0.2: U3.3 20.05,37.22 20.57,36.7 24.69,36.7 25.35,37.36 25.35,40.1 Q4.1
N$19
  Bottom 0.2: U5.4 64.48,28.32 63.05,29.74 63.05,32.54 63.46,32.95 64.81,32.95 C15.1
N$20
  Bottom 0.2: C9.1 20.72,15.78 21.29,16.35 U2.4
N$21
  Bottom 0.2: C9.2 18.39,16.93 18.8,17.34 19.74,17.34 20.03,17.63 U2.5
N$22
  Bottom 0.2: C11.2 22.56,16.29 U2.3
N$23
  Bottom 0.2: C11.1 25.09,15.9 U2.1
N$24
  Bottom 0.2: U5.5 65.75,28.45 64.83,29.37 C15.2
N$25
  Top 0.2: PROSES.A 83.47,30.34 83.84,30.71 85.23,30.71 85.55,31.03 R12.1
N$26  (via drill 0.25)
  Top 0.2: v61.26,29.01 67.27,29.01 v67.87,29.61 | v67.87,29.61 | v67.87,29.61 v67.86,29.62
  Bottom 0.2: U5.2 61.94,28.33 v61.26,29.01 | v67.86,29.62 67.85,29.63 C17.1
N$27
  Bottom 0.2: C16.2 73.47,27.44 72.23,28.69 67.37,28.69 67.03,28.35 67.03,27.17 U5.6
N$28
  Top 0.2: R13.1 85.61,17.02 85.27,17.36 83.72,17.36 83.44,17.64 83.44,18.95 WARNING.A
N$29  (via drill 0.25)
  Top 0.2: K1.16 40.58,15.14 3.37,15.14 1.12,17.39 1.12,35.22 3.5,37.61 11.61,37.61 17.23,43.23 17.23,55.42 18.33,56.52 21.08,56.52 22.07,55.53 22.07,53.43 v23.47,52.03 | v26.33,43.85 26.33,42.36 Q4.3
  Bottom 0.2: K1.16 41.44,17.46 41.96,17.98 D7.A | v23.47,52.03 23.47,51.07 26.32,48.23 26.32,43.87 v26.33,43.85
N$34
  Bottom 1.016: X1.1 19.73,43.2 10.65,34.13 10.65,30.44 7.78,27.57 5.07,27.57 2.84,25.33 PS1.2 2.84,19.83 4.04,18.63 MINI1.IN-
N$35
  Bottom 0.2: PS1.4 36.44,20.37 33.74,23.07 D4.A
N$38  (via drill 0.25)
  Top 0.2: D9.C 78.46,26.03 77.98,26.51 70.27,26.51 69.58,25.81 v69.58,23.94
  Bottom 0.2: v69.58,23.94 69.58,22.23 U5.9
N$39  (via drill 0.25)
  Top 0.2: v16.25,25.6 16.25,35.1 17.2,36.05 29.92,36.05 30.75,36.88 30.75,39.68 D10.C
  Bottom 0.2: U2.9 16.21,25.57 v16.25,25.6
N$40
  Bottom 0.2: D11.C 53.65,21.25 54.44,20.46 60.44,20.46 63.03,17.87 EBYTEE220-900T22D1.TXD
OUT+  (via drill 0.25)
  Top 0.2: R10.2 33.04,49.42 34.36,50.74 34.36,55.69 36.22,57.54 v38.84,57.54 | v68.12,57 68.12,53.88 | 68.12,53.88 68.12,53.51 | 68.12,53.51 68.12,53.36 | 68.12,53.36 67.51,52.75 61.97,52.75 61.43,53.29 C4.2 | EBYTEE220-900T22D1.VCC 68.11,19.55 68.64,20.08 71.15,20.08 v75.96,24.89 v75.97,24.89 | R3.2 83.63,35.53 v82,35.53 82,37.54 80.99,38.56 80.99,40.8 80.47,41.31 73.84,41.31 71.22,43.94 71.22,52.81 70.66,53.36 68.59,53.36 | 68.12,53.36 68.59,53.36 | 68.12,53.88 68.45,53.55 | 68.45,53.55 68.59,53.41 68.59,53.36 | 68.12,53.51 68.16,53.55 68.45,53.55
  Bottom 0.2: EBYTEE220-900T22D1.VCC 68.14,17.75 68.14,15.6 67.03,14.5 49.06,14.5 K1.1 49.06,17.4 48.48,17.98 D7.C 47.19,19.34 46.78,19.75 40.28,19.75 36.96,23.07 D4.C 36.2,23.09 D2.C 36.22,25.4 D3.C 35.38,27.75 35.02,28.11 35.02,34.37 34.39,35 30.91,35 30.36,34.45 30.36,30.8 29.91,30.35 U1.3 | v38.84,57.54 39.74,57.54 41.29,56 41.29,53.31 41.97,52.62 50.24,52.62 51.25,53.63 51.25,56.99 51.96,57.7 67.42,57.7 v68.12,57 | v75.97,24.89 75.97,34.89 76.63,35.55 82,35.55 v82,35.53
R2IN
  Bottom 0.2: J1.3 60.09,12.62 60.71,13.25 67.92,13.25 69.57,14.89 69.57,19.04 71.85,21.33 71.85,25.05 71.14,25.77 71.14,25.78 69.81,25.78 69.56,26.03 U5.8
R2IN1
  Bottom 0.2: J2.3 27.76,10.14 27.31,9.68 21.09,9.68 20.46,10.32 20.46,11.98 19.74,12.7 17.68,12.7 16.21,14.17 U2.8
RTS  (via drill 0.25)
  Top 0.2: v44.42,49.65 44.36,49.65 43.05,48.34 43.05,46.18 43.49,45.74 U$2.14 | v17.72,39.05 15.47,36.8 15.47,32.71 v15,32.24
  Bottom 0.2: Q1.2 v15,32.24 15,33.16 R2.1 | v44.42,49.65 44.42,50.21 43.97,50.66 42.51,50.66 41.7,49.84 35.27,49.84 34.68,50.43 34.68,55.83 33.41,57.1 24.25,57.1 21.7,54.55 21.7,43.36 17.72,39.38 v17.72,39.05
RX  (via drill 0.25)
  Top 0.2: D6.C 42.05,37 v41.42,37.64 | v37.68,45.76 U$2.3
  Bottom 0.2: MD1.35 50.96,51.13 47.73,47.9 36.77,47.9 35.93,47.05 35.93,44.37 38.94,41.35 38.94,37.26 39.65,36.55 41.07,36.55 41.42,36.9 v41.42,37.64 41.42,40.7 37.83,44.29 37.68,44.44 v37.68,45.76
RX_DB9
  Top 0.2: R15.1 78.66,19.96 D9.A 78.44,20.18 73.67,20.18 72.86,19.36 72.86,16.33 70.63,14.1 54.49,14.1 53.76,14.83 53.76,21.16 53.02,21.9 K1.P1
RX_DB9-1
  Top 0.2: D10.A 32.18,43.98 32.55,43.61 32.55,40.3 32.97,39.89 R16.1 34.23,39.88 34.23,38.24 34.86,37.61 37.4,37.61 38.17,36.84 38.17,32.97 39.08,32.06 K1.S2
RXLORA
  Top 0.2: R6.1 81.16,22.23 74.58,22.23 72.21,19.87 72.21,16.6 70.29,14.67 61.31,14.67 60.45,15.53 60.45,17.73 EBYTEE220-900T22D1.RXD
  Bottom 0.2: K1.O1 49.06,28.59 | 49.06,28.59 49.06,28.74 49.81,29.5 57.2,29.5 57.72,30.03 D5.A | EBYTEE220-900T22D1.RXD 60.49,19.37 60,19.86 52.31,19.86 51.94,20.23 51.94,24.3 51.38,24.85 39.95,24.85 39.37,25.44 39.37,28.34 39.77,28.74 48.91,28.74 49.06,28.59
SCL
  Bottom 0.2: X2.2 31.93,49.27 32.54,48.65 47.42,48.65 51.17,52.4 MD1.36
SDA
  Bottom 0.2: X2.3 26.85,50.52 27.59,49.78 30.53,49.78 32.29,48.02 34.56,48.02 35.32,47.26 35.32,44.08 38.4,41 38.4,36.98 39.27,36.11 47.12,36.11 48.68,37.66 48.68,46.61 50.65,48.59 MD1.33
SW_MODEM  (via drill 0.25)
  Top 0.2: v51.98,47.17 52.67,47.85 57.4,47.85 58.34,46.91 58.34,44.63 56.43,42.71 56.43,35.05 58.54,32.94 58.54,22.11 57.87,21.44 56.17,21.44 54.86,22.74 53.51,22.74 51.7,24.55 47.81,24.55 43.13,19.87 39.82,19.87 37.93,21.76 29.8,21.76 28.11,23.44 22.51,23.44 18.87,19.8 15.74,19.8 14.14,21.4 14.14,25.58 13.47,26.25 10.91,26.25 10.27,26.89 10.27,28.75 13.47,31.95 13.47,37.27 18.37,42.17 22.12,42.17 26.44,46.49 R9.1
  Bottom 0.2: v51.98,47.17 51.98,43.91 52.43,43.46 54.07,43.46 MD1.29
T2OUT
  Bottom 0.2: J1.2 57.32,13.03 58.12,13.84 67.62,13.84 69.18,15.39 69.18,19.34 71.28,21.45 71.28,24.8 70.9,25.19 68.67,25.19 68.24,25.61 68.24,27.12 U5.7
T2OUT1
  Bottom 0.2: J2.2 24.99,12.76 24.58,13.18 17.94,13.18 16.69,14.43 16.69,16.67 17.47,17.45 17.47,18.56 17.44,18.59 17.44,19.07 U2.7
TX  (via drill 0.25)
  Top 0.2: D1.C 40,37.32 39.94,37.39 v39.94,37.67 | v37.21,47.02 U$2.2
  Bottom 0.2: v39.94,37.67 39.94,41.28 36.63,44.59 36.63,46.63 37.02,47.02 v37.21,47.02 47.64,47.02 50.48,49.86 MD1.34
TX_DB9
  Bottom 0.2: K1.P2 42.81,20.53 50.2,20.53 50.78,19.95 50.78,15.93 51.56,15.15 66.35,15.15 66.8,15.6 66.8,19.33 68.29,20.81 U5.10
TX_DB9-1  (via drill 0.25)
  Top 0.2: v17.46,22.1 17.46,23.94 18.47,24.94 44.79,24.94 45.81,25.96 45.81,29.49 48.38,32.06 K1.S1
  Bottom 0.2: U2.10 17.48,22.13 v17.46,22.1
TXLORA  (via drill 0.25)
  Top 0.2: v55.23,24.88 55.23,31.27 55.65,31.69 55.65,43.41 57.34,45.11 57.34,46.52 56.84,47.03 53.48,47.03 51.85,45.4 51.85,41.33 v52.18,40.99
  Bottom 0.2: R17.1 v55.23,24.88 D11.A 52.51,26.46 51.36,25.31 42.01,25.31 41.44,25.88 K1.O2 | v52.18,40.99 54.09,40.99 MD1.27
USB_N
  Top 0.2: J3.2 46.57,53.15 45.37,51.95 42.98,51.95 42.12,51.09 42.12,43.35 40.7,41.93 U$2.6
USB_P
  Top 0.2: J3.3 45.92,53 45.25,52.33 42.78,52.33 41.75,51.31 41.75,43.49 41.47,43.21 41.47,43.2 U$2.5
VUSB  (via drill 0.25)
  Top 0.2: U$2.16 46.25,49.62 46.25,52.22 47.22,53.2 | 47.22,53.2 47.22,53.64 | 47.22,53.64 47.22,53.85 | 47.22,53.85 47.22,54.09 | 47.22,54.09 J3.1 | 47.22,53.2 47.45,53.42 | 47.45,53.42 47.48,53.46 | 47.48,53.46 47.67,53.64 | 47.67,53.64 51.26,53.64 51.67,54.05 51.67,56.32 52.16,56.81 56.53,56.81 56.93,56.41 56.93,54.98 57.23,54.67 C1.1 59.42,54.37 59.42,44.23 57.33,42.13 57.33,38.54 61.2,34.67 73.51,34.67 75.19,32.99 C25.+ 75.19,28.76 75.65,28.3 81.22,28.3 85.34,24.18 v85.34,23.85 | v29.95,27.75 29.95,28.62 30.8,29.47 v32.82,29.47 | 47.67,53.64 47.22,54.09 | 47.22,53.85 47.48,53.59 47.48,53.46 | 47.22,53.64 47.43,53.42 47.45,53.42
  Bottom 0.2: v85.34,23.85 85.34,22.28 84.91,21.85 75.4,21.85 72.19,18.63 72.19,15.69 68.11,11.6 68.11,6.31 66.89,5.09 36.02,5.09 35.11,5.99 35.11,20.57 34.3,21.38 32.34,21.38 31.7,22.02 31.7,24.96 29.95,26.7 v29.95,27.75 | v32.82,29.47 32.82,27.79 D3.A

### Text on the board
tNames: Version 1.0